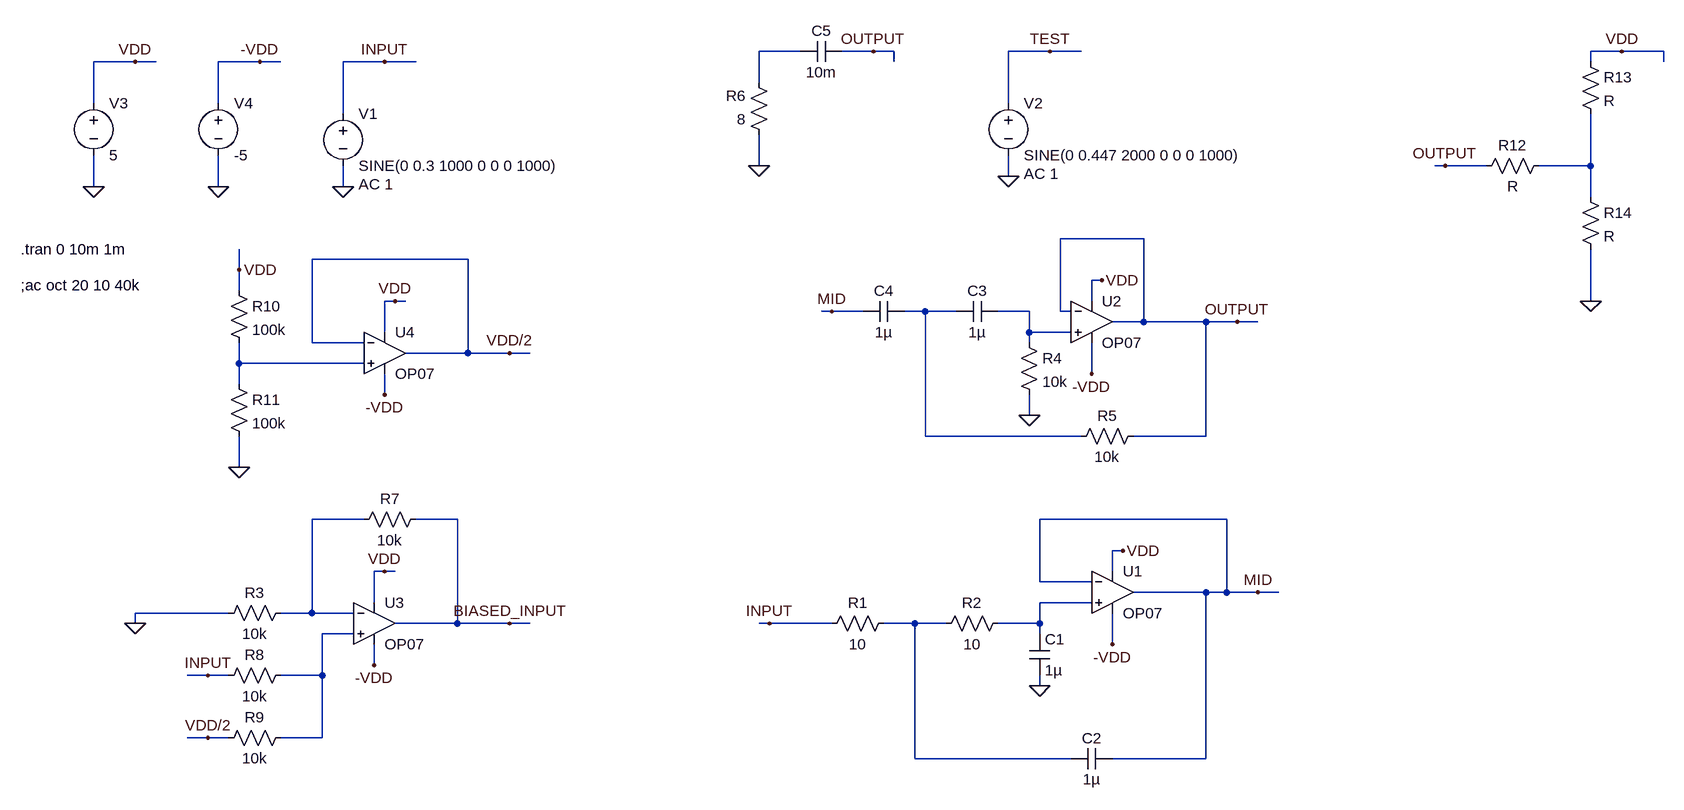
[diagram p0: schematic sallen-key-sim.asc]
sallen-key-sim.asc, the LTspice schematic file:
Version 4
SHEET 1 2468 856
WIRE 1136 -368 1072 -368
WIRE 1248 -368 1200 -368
WIRE 1280 -368 1248 -368
WIRE 1520 -368 1456 -368
WIRE 1568 -368 1520 -368
WIRE 2400 -368 2352 -368
WIRE 2464 -368 2400 -368
WIRE 112 -352 48 -352
WIRE 144 -352 112 -352
WIRE 304 -352 240 -352
WIRE 336 -352 304 -352
WIRE 496 -352 432 -352
WIRE 544 -352 496 -352
WIRE 1280 -352 1280 -368
WIRE 2352 -352 2352 -368
WIRE 2464 -352 2464 -368
WIRE 1072 -320 1072 -368
WIRE 48 -288 48 -352
WIRE 240 -288 240 -352
WIRE 1456 -288 1456 -368
WIRE 432 -272 432 -352
WIRE 1072 -192 1072 -240
WIRE 2128 -192 2112 -192
WIRE 2192 -192 2128 -192
WIRE 2352 -192 2352 -272
WIRE 2352 -192 2272 -192
WIRE 1456 -176 1456 -208
WIRE 48 -160 48 -208
WIRE 240 -160 240 -208
WIRE 432 -160 432 -192
WIRE 2352 -144 2352 -192
WIRE 1664 -80 1536 -80
WIRE 624 -48 384 -48
WIRE 272 -32 272 -64
WIRE 1600 -16 1584 -16
WIRE 272 0 272 -32
WIRE 512 16 496 16
WIRE 528 16 512 16
WIRE 1584 16 1584 -16
WIRE 2352 16 2352 -64
WIRE 2352 16 2336 16
WIRE 1184 32 1168 32
WIRE 1232 32 1184 32
WIRE 1328 32 1296 32
WIRE 1376 32 1328 32
WIRE 1488 32 1440 32
WIRE 1536 32 1536 -80
WIRE 1552 32 1536 32
WIRE 1664 48 1664 -80
WIRE 1664 48 1616 48
WIRE 1760 48 1664 48
WIRE 1808 48 1760 48
WIRE 1840 48 1808 48
WIRE 496 64 496 16
WIRE 1488 64 1488 32
WIRE 1552 64 1488 64
WIRE 384 80 384 -48
WIRE 464 80 384 80
WIRE 1488 80 1488 64
WIRE 624 96 624 -48
WIRE 624 96 528 96
WIRE 688 96 624 96
WIRE 720 96 688 96
WIRE 272 112 272 80
WIRE 464 112 272 112
WIRE 1584 128 1584 80
WIRE 272 144 272 112
WIRE 496 160 496 128
WIRE 1488 192 1488 160
WIRE 1328 224 1328 32
WIRE 1568 224 1328 224
WIRE 1760 224 1760 48
WIRE 1760 224 1648 224
WIRE 272 272 272 224
WIRE 464 352 384 352
WIRE 608 352 544 352
WIRE 1792 352 1504 352
WIRE 1632 400 1616 400
WIRE 496 432 480 432
WIRE 512 432 496 432
WIRE 1616 432 1616 400
WIRE 1504 448 1504 352
WIRE 1584 448 1504 448
WIRE 1760 464 1648 464
WIRE 1792 464 1792 352
WIRE 1792 464 1760 464
WIRE 1840 464 1792 464
WIRE 1872 464 1840 464
WIRE 480 480 480 432
WIRE 1584 480 1504 480
WIRE 256 496 112 496
WIRE 384 496 384 352
WIRE 384 496 336 496
WIRE 448 496 384 496
WIRE 112 512 112 496
WIRE 608 512 608 352
WIRE 608 512 512 512
WIRE 688 512 608 512
WIRE 720 512 688 512
WIRE 1088 512 1072 512
WIRE 1184 512 1088 512
WIRE 1312 512 1264 512
WIRE 1360 512 1312 512
WIRE 1504 512 1504 480
WIRE 1504 512 1440 512
WIRE 448 528 400 528
WIRE 1504 528 1504 512
WIRE 1616 544 1616 496
WIRE 480 576 480 544
WIRE 224 592 192 592
WIRE 256 592 224 592
WIRE 400 592 400 528
WIRE 400 592 336 592
WIRE 1504 608 1504 592
WIRE 224 688 192 688
WIRE 256 688 224 688
WIRE 400 688 400 592
WIRE 400 688 336 688
WIRE 1312 720 1312 512
WIRE 1552 720 1312 720
WIRE 1760 720 1760 464
WIRE 1760 720 1616 720
FLAG 432 -160 0
FLAG 1504 608 0
FLAG 48 -160 0
FLAG 112 -352 VDD
FLAG 1632 400 VDD
FLAG 1488 192 0
FLAG 1072 -192 0
FLAG 1840 464 MID
FLAG 496 -352 INPUT
FLAG 1808 48 OUTPUT
FLAG 1088 512 INPUT
FLAG 496 432 VDD
FLAG 112 512 0
FLAG 224 592 INPUT
FLAG 224 688 VDD/2
FLAG 688 512 BIASED_INPUT
FLAG 512 16 VDD
FLAG 272 272 0
FLAG 272 -32 VDD
FLAG 688 96 VDD/2
FLAG 1456 -176 0
FLAG 1520 -368 TEST
FLAG 1248 -368 OUTPUT
FLAG 1600 -16 VDD
FLAG 1184 32 MID
FLAG 240 -160 0
FLAG 304 -352 -VDD
FLAG 496 160 -VDD
FLAG 480 576 -VDD
FLAG 1616 544 -VDD
FLAG 1584 128 -VDD
FLAG 2352 16 0
FLAG 2128 -192 OUTPUT
FLAG 2400 -368 VDD
SYMBOL voltage 432 -288 R0
WINDOW 123 24 124 Left 2
WINDOW 39 0 0 Left 2
SYMATTR Value2 AC 1
SYMATTR InstName V1
SYMATTR Value SINE(0 0.3 1000 0 0 0 1000)
SYMBOL res 1280 496 R90
WINDOW 0 0 56 VBottom 2
WINDOW 3 32 56 VTop 2
SYMATTR InstName R1
SYMATTR Value 10
SYMBOL res 1456 496 R90
WINDOW 0 0 56 VBottom 2
WINDOW 3 32 56 VTop 2
SYMATTR InstName R2
SYMATTR Value 10
SYMBOL cap 1488 528 R0
SYMATTR InstName C1
SYMATTR Value 1µ
SYMBOL cap 1552 736 R270
WINDOW 0 32 32 VTop 2
WINDOW 3 0 32 VBottom 2
SYMATTR InstName C2
SYMATTR Value 1µ
SYMBOL Opamps\\OP07 1616 400 R0
SYMATTR InstName U1
SYMBOL voltage 48 -304 R0
WINDOW 123 0 0 Left 2
WINDOW 39 0 0 Left 2
SYMATTR InstName V3
SYMATTR Value 5
SYMBOL Opamps\\OP07 1584 -16 R0
SYMATTR InstName U2
SYMBOL cap 1440 16 R90
WINDOW 0 0 32 VBottom 2
WINDOW 3 32 32 VTop 2
SYMATTR InstName C3
SYMATTR Value 1µ
SYMBOL cap 1296 16 R90
WINDOW 0 0 32 VBottom 2
WINDOW 3 32 32 VTop 2
SYMATTR InstName C4
SYMATTR Value 1µ
SYMBOL res 1472 64 R0
SYMATTR InstName R4
SYMATTR Value 10k
SYMBOL res 1664 208 R90
WINDOW 0 0 56 VBottom 2
WINDOW 3 32 56 VTop 2
SYMATTR InstName R5
SYMATTR Value 10k
SYMBOL res 1088 -224 R180
WINDOW 0 36 76 Left 2
WINDOW 3 36 40 Left 2
SYMATTR InstName R6
SYMATTR Value 8
SYMBOL Opamps\\OP07 480 448 R0
SYMATTR InstName U3
SYMBOL res 352 480 R90
WINDOW 0 0 56 VBottom 2
WINDOW 3 32 56 VTop 2
SYMATTR InstName R3
SYMATTR Value 10k
SYMBOL res 448 368 R270
WINDOW 0 32 56 VTop 2
WINDOW 3 0 56 VBottom 2
SYMATTR InstName R7
SYMATTR Value 10k
SYMBOL res 240 608 R270
WINDOW 0 32 56 VTop 2
WINDOW 3 0 56 VBottom 2
SYMATTR InstName R8
SYMATTR Value 10k
SYMBOL res 240 704 R270
WINDOW 0 32 56 VTop 2
WINDOW 3 0 56 VBottom 2
SYMATTR InstName R9
SYMATTR Value 10k
SYMBOL Opamps\\OP07 496 32 R0
SYMATTR InstName U4
SYMBOL res 256 -16 R0
SYMATTR InstName R10
SYMATTR Value 100k
SYMBOL res 256 128 R0
SYMATTR InstName R11
SYMATTR Value 100k
SYMBOL voltage 1456 -304 R0
WINDOW 123 24 124 Left 2
WINDOW 39 0 0 Left 2
SYMATTR Value2 AC 1
SYMATTR InstName V2
SYMATTR Value SINE(0 0.447 2000 0 0 0 1000)
SYMBOL cap 1200 -384 R90
WINDOW 0 0 32 VBottom 2
WINDOW 3 32 32 VTop 2
SYMATTR InstName C5
SYMATTR Value 10m
SYMBOL voltage 240 -304 R0
WINDOW 123 0 0 Left 2
WINDOW 39 0 0 Left 2
SYMATTR InstName V4
SYMATTR Value -5
SYMBOL res 2288 -208 R90
WINDOW 0 0 56 VBottom 2
WINDOW 3 32 56 VTop 2
SYMATTR InstName R12
SYMBOL res 2336 -368 R0
SYMATTR InstName R13
SYMBOL res 2336 -160 R0
SYMATTR InstName R14
TEXT -64 -64 Left 2 !.tran 0 10m 1m
TEXT -64 -8 Left 2 !;ac oct 20 10 40k

The netlist it stands for:
* sallen-key-sim.asc
V1 INPUT 0 SINE(0 0.3 1000 0 0 0 1000) AC 1
R1 N008 INPUT 10
R2 N007 N008 10
C1 N007 0 1µ
C2 N008 MID 1µ
XU1 N007 MID VDD -VDD MID LT1001  ; OP07, pins In+ In- V+ V- OUT
V3 VDD 0 5
XU2 N004 OUTPUT VDD -VDD OUTPUT LT1001  ; OP07, pins In+ In- V+ V- OUT
C3 N004 N003 1µ
C4 N003 MID 1µ
R4 N004 0 10k
R5 OUTPUT N003 10k
R6 0 N001 8
XU3 N009 N006 VDD -VDD BIASED_INPUT LT1001  ; OP07, pins In+ In- V+ V- OUT
R3 N006 0 10k
R7 N006 BIASED_INPUT 10k
R8 INPUT N009 10k
R9 VDD/2 N009 10k
XU4 N005 VDD/2 VDD -VDD VDD/2 LT1001  ; OP07, pins In+ In- V+ V- OUT
R10 VDD N005 100k
R11 N005 0 100k
V2 TEST 0 SINE(0 0.447 2000 0 0 0 1000) AC 1
C5 OUTPUT N001 10m
V4 -VDD 0 -5
R12 N002 OUTPUT R
R13 VDD N002 R
R14 N002 0 R
.tran 0 10m 1m
;ac oct 20 10 40k
.lib LTC.lib
.backanno
.end